# EAGLE board Audio_Test_Board (EAGLE 9.6.2)
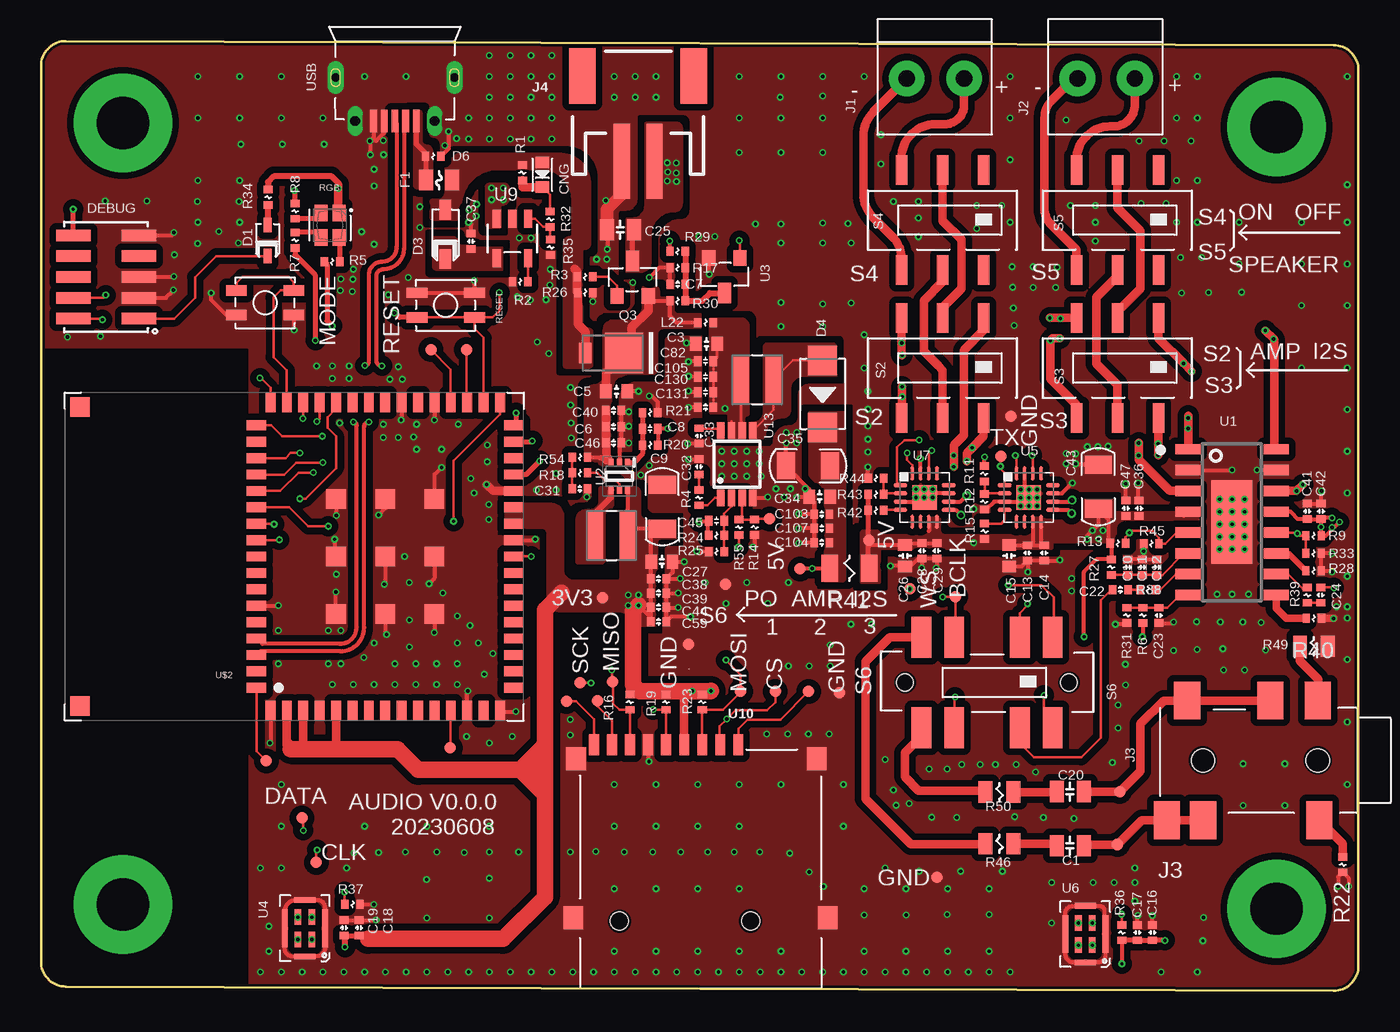
[diagram p3: board, top side]
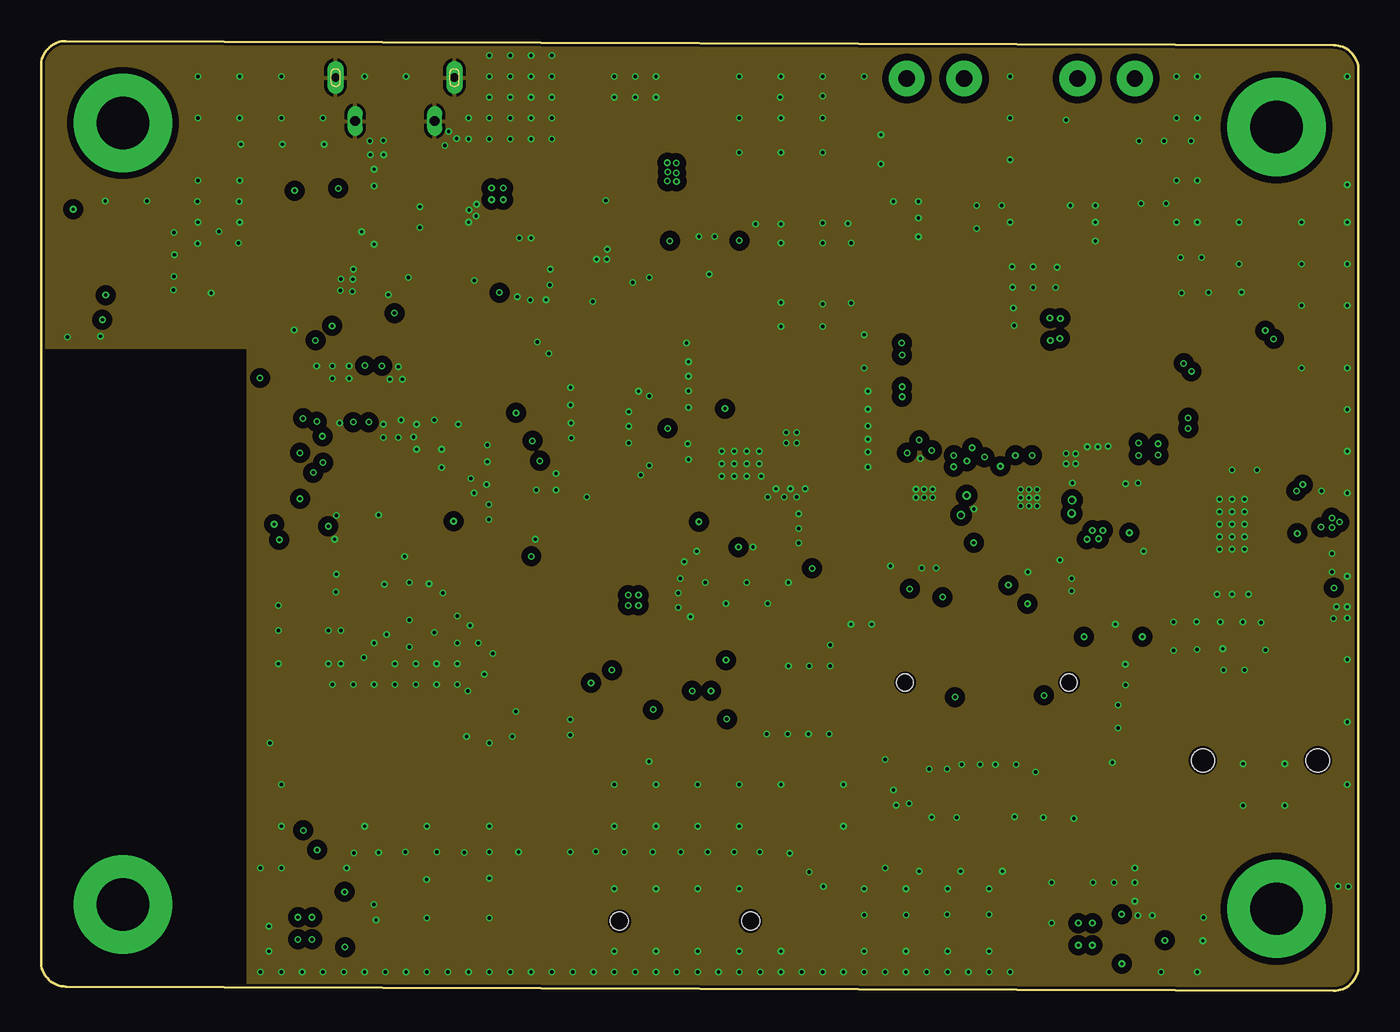
[diagram p4: board, inner layer Route2]
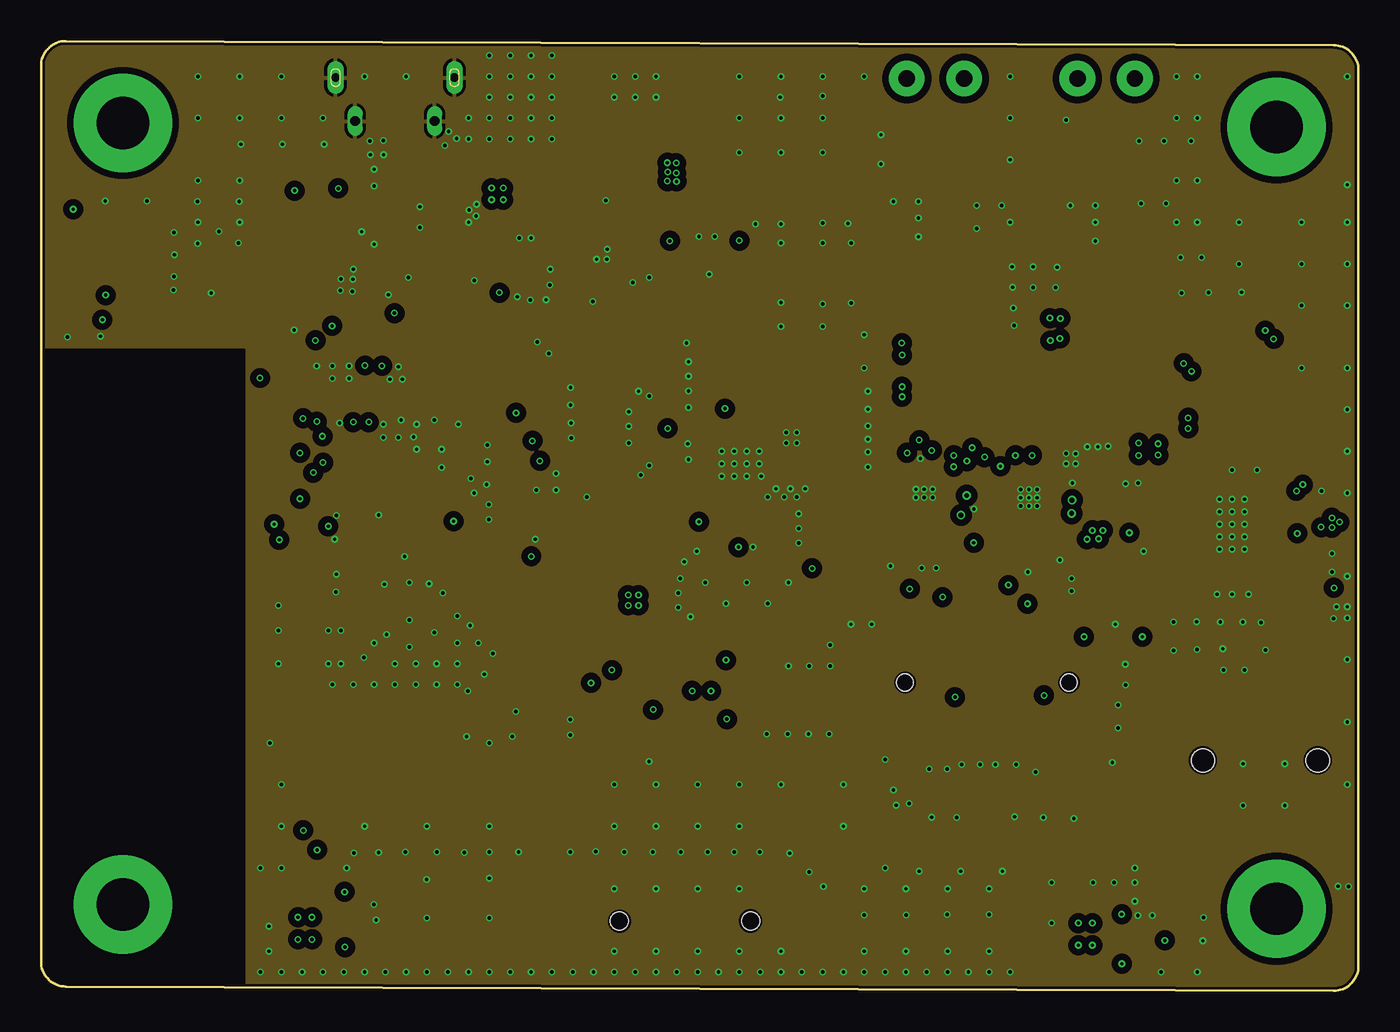
[diagram p5: board, inner layer Route15]
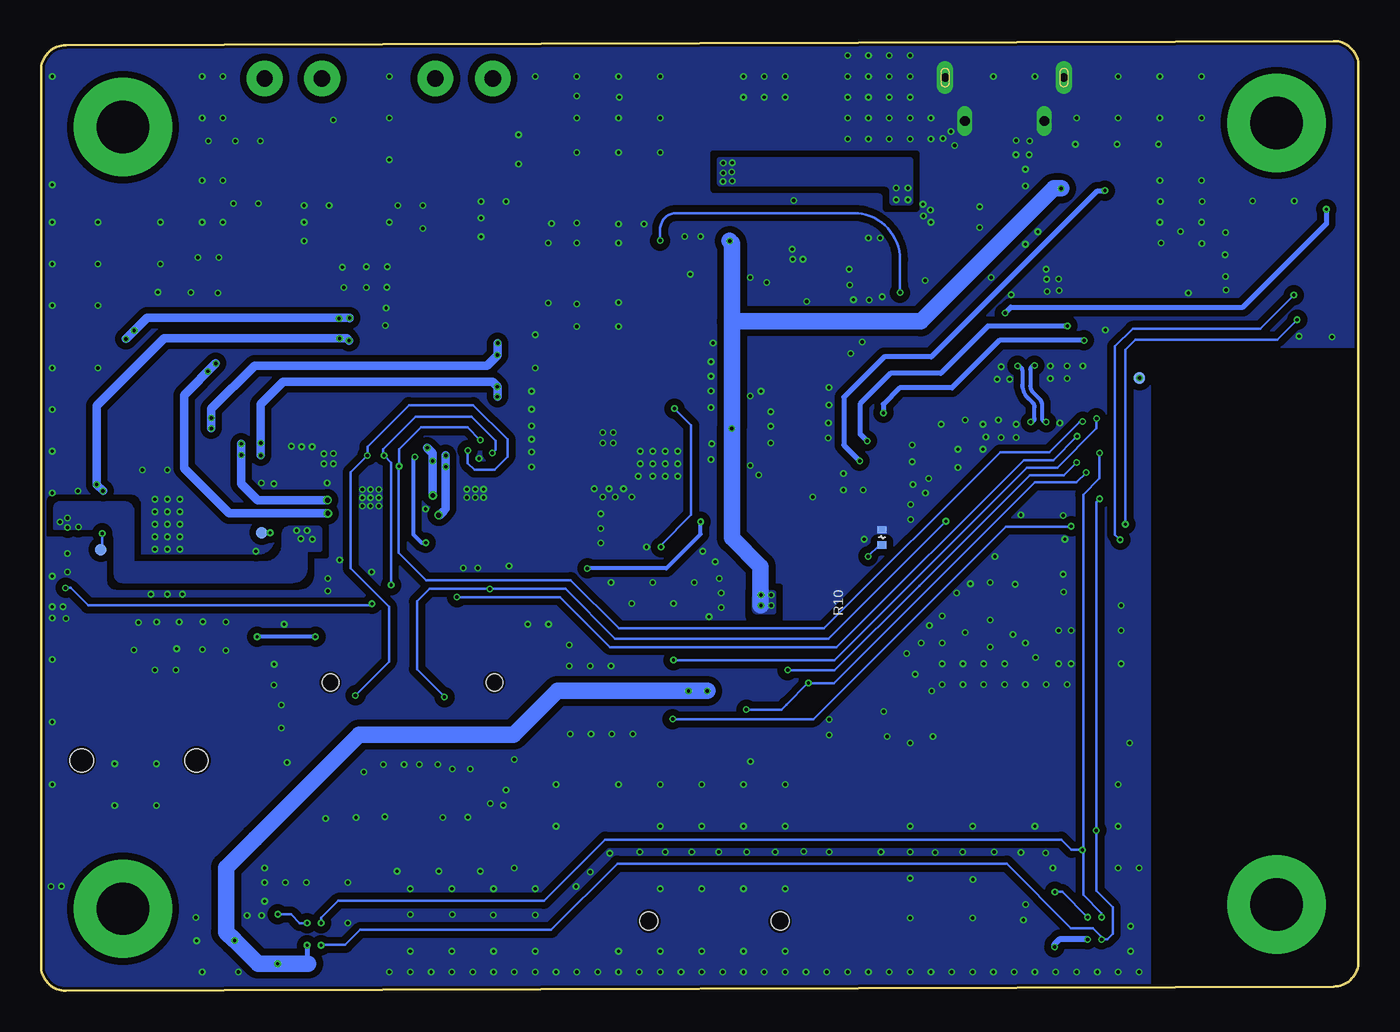
[diagram p6: board, bottom side, seen from below]

Size 80.37 x 57.91 mm. Coordinates in mm from the lower left corner, seen from the top.
Outline: 1.52,0.25 arc-90 0,1.78 0,56.39 arc-90 1.52,57.91 78.84,57.66 arc-90 80.37,56.13 80.37,1.52 arc-90 78.84,0 1.52,0.25
Copper layers (1+2*15+16): Top 0.035mm / dielectric 0.2mm / Route2 0.035mm / dielectric 0.15mm / Route15 0.035mm / dielectric 0.2mm / Bottom 0.035mm
Design rules "default *": minimum track width 4mil, minimum drill 0.1mm, track to track 8mil, track to pad 4mil, pad to pad 4mil, via to via 6mil, smd to smd 0mil, copper to edge 6mil, drill to drill 6mil, minimum pad ring 4mil, minimum via ring 4mil, stop-mask expansion 0mil, vias tented up to drill 20mil, thermal gap 8mil
Net classes: 0 default: width 0.152 mm, drill 0.203 mm, clearance 0.152 mm; 1 power: width 0.254 mm, drill 0.203 mm, clearance 0.406 mm; 2 DIIFF: width 0.242 mm, clearance 0.152 mm
tRestrict: 2 lines

## Footprints (pad centres in the part's own frame; a part is rotated, then mirrored left to right if it is on the bottom)
TS-1185A-020 = smd 1.27 x 0.635: 1 -1.75,0.752; 2 1.75,0.752; 3 -1.75,-0.752; 4 1.75,-0.752
C0805 = smd 0.85 x 1.3: 1 -0.8,0; 2 0.85,0
C0603 = smd 0.7 x 0.85: 1 -0.65,0; 2 0.65,0
C-0402 = smd 0.45 x 0.55: 1 -0.47,0; 2 0.47,0
C0402 = smd 0.45 x 0.6: 1 -0.47,0; 2 0.47,0
C1206 = smd 1.1 x 1.65: 1 -1.35,0; 2 1.35,0
LED0603 = smd 0.7 x 0.8: 1 -0.75,0; 2 0.75,0
SOD-323 = smd 0.9 x 0.5: 1 -0.95,0; 2 0.95,0
DIODE-DO-220AA_NT(SMP) = smd 0.762 x 1.27: ANODE 2.349,0 | smd 2.337 x 2.464: CATHODE 0,0
SOD-123 = smd 1.2 x 0.7: 1 -1.5,0; 2 1.5,0
DO-214AC = smd 1.8 x 1.77: 1 -2.042,0; 2 2.042,0
R-0402S = smd 0.45 x 0.55: 1 -0.47,0; 2 0.47,0
CON5X2_1.27 = smd 0.7 x 2.1: 1 -2.54,-2; 2 -2.54,2; 3 -1.27,-2; 4 -1.27,2; 5 0,-2; 6 0,2; 7 1.27,-2; 8 1.27,2; 9 2.54,-2; 10 2.54,2
F0805 = smd 0.85 x 1.25: P$1 -0.8,0; P$2 0.8,0
1X2-3.5MM = drill 1 pad 2.184: 1 1.8,0; 2 -1.7,0
PJ3825 = smd 2.3 x 1.6: P$1 -3.65,4.55; P$2 3.65,4.65; P$3 -3.65,1.65; P$4 3.65,-2.45; P$5 3.65,-4.65; P$6 -3.65,-3.425 | hole 1.4: 0,4.55; 0,-2.45
JST-2-SMD = smd 1 x 4.6: 1 -1,-3.7; 2 1,-3.7 | smd 1.6 x 3.4: NC1 -3.4,1.5; NC2 3.4,1.5
INDUCTOR-VLS-E = smd 1 x 3: P$1 -1,0; P$2 1,0
TRON = smd 1.2 x 0.6: 1 0.6,15.45; 2 0.6,14.45; 3 0.6,13.45; 4 0.6,12.45; 5 0.6,11.45; 6 0.6,10.45; 7 0.6,9.45; 8 0.6,8.45; 9 0.6,7.45; 10 0.6,6.45; 11 0.6,5.45; 12 0.6,4.45; 13 0.6,3.45; 14 0.6,2.45; 15 0.6,1.45; 33 19.4,1.45; 34 19.4,2.45; 35 19.4,3.45; 36 19.4,4.45; 37 19.4,5.45; 38 19.4,6.45; 39 19.4,7.45; 40 19.4,8.45; 41 19.4,9.45; 42 19.4,10.45; 43 19.4,11.45; 44 19.4,12.45; 45 19.4,13.45; 46 19.4,14.45; 47 19.4,15.45 | smd 0.6 x 1.2: 16 2,0.6; 17 3,0.6; 18 4,0.6; 19 5,0.6; 20 6,0.6; 21 7,0.6; 22 8,0.6; 23 9,0.6; 24 10,0.6; 25 11,0.6; 26 12,0.6; 27 13,0.6; 28 14,0.6; 29 15,0.6; 30 16,0.6; 31 17,0.6; 32 18,0.6; 48 18,16.3; 49 17,16.3; 50 16,16.3; 51 15,16.3; 52 14,16.3; 53 13,16.3; 54 12,16.3; 55 11,16.3; 56 10,16.3; 57 9,16.3; 58 8,16.3; 59 7,16.3; 60 6,16.3; 61 5,16.3; 62 4,16.3; 63 3,16.3; 64 2,16.3 | smd 1.2 x 1.2: 65 6.5,11.45; 66 6.5,8.45; 67 6.5,5.45; 68 10,11.45; 69 10,8.45; 70 10,5.45; 71 13.5,11.45; 72 13.5,8.45; 73 13.5,5.45; 74 19.12,27.07; 75 0.88,27.07
SOT-23 = smd 0.8 x 0.95: 1 -0.95,-1; 2 0.95,-1 | smd 0.8 x 1.25: 3 0,1.15
R1206 = smd 1 x 1.65: 1 -1.2,0; 2 1.2,0
R0805 = smd 0.85 x 1.3: 1 -0.85,0; 2 0.85,0
PLCC4-2MM-RGB = smd 1 x 0.8: BLUE -0.75,-0.55; CA 0.75,-0.55; GREEN -0.75,0.55; RED 0.75,0.55
SS-3235S-L1_SMD = smd 0.7 x 1.8: 1 -2.5,3.05; 2 0,3.05; 3 2.5,3.05; 4 -2.5,-3.05; 5 0,-3.05; 6 2.5,-3.05
SWITCH-JS207011SCQNR = smd 1.2 x 2.5: 1 -4,-2.75; 2 -2,-2.75; 3 2,-2.75; 4 4,-2.75; 5 -4,2.75; 6 -2,2.75; 7 2,2.75; 8 4,2.75 | hole 1: -5,0; 5,0
TP0.7MM = smd 0.7 x 0.7: P$1 0,0
PARTICLE-SZ_SOIC16 = smd 0.635 x 1.524: 1 -4.445,-2.695; 2 -3.175,-2.695; 3 -1.905,-2.695; 4 -0.635,-2.695; 5 0.635,-2.695; 6 1.905,-2.695; 7 3.175,-2.695; 8 4.445,-2.695; 9 4.445,2.695; 10 3.175,2.695; 11 1.905,2.695; 12 0.635,2.695; 13 -0.635,2.695; 14 -1.905,2.695; 15 -3.175,2.695; 16 -4.445,2.695 | smd 5.1 x 2.5: THERM 0,0
SOTFL50P160X60-6N = smd 0.475 x 0.3: 1 -0.838,0.5; 2 -0.838,0; 3 -0.838,-0.5; 4 0.838,-0.5; 5 0.838,0; 6 0.838,0.5
PARTICLE-SZ_SOT-23 = smd 0.8 x 0.95: 1 -0.95,-1; 2 0.95,-1 | smd 0.8 x 1.25: 3 0,1.15
MP34DT = smd 0.95 x 0.4: 1 -0.675,-0.425; 2 0.675,-0.425; 3 0.675,0.425; 4 -0.675,0.425 | smd 2.3 x 0.35: 5 0,1.225; 6 0,-1.225 | smd 0.35 x 1.3: 7 1.725,0; 8 -1.725,0
QFN16 = smd 0.85 x 0.25: 1 -1.475,0.75; 2 -1.475,0.25; 3 -1.475,-0.25; 4 -1.475,-0.75; 9 1.475,-0.75; 10 1.475,-0.25; 11 1.475,0.25; 12 1.475,0.75 | smd 0.25 x 0.85: 5 -0.75,-1.475; 6 -0.25,-1.475; 7 0.25,-1.475; 8 0.75,-1.475; 13 0.75,1.475; 14 0.25,1.475; 15 -0.25,1.475; 16 -0.75,1.475 | smd 1.5 x 1.5: TH 0,0
SOT-23-5 = smd 1.1 x 0.508: 1 -1.2,0.953; 2 -1.2,0; 3 -1.2,-0.953; 4 1.2,-0.953; 5 1.2,0.953
MICROSD = smd 0.6 x 1.3: 1 2.3,5.276; 2 1.2,5.276; 3 0.101,5.276; 4 -0.999,5.276; 5 -2.099,5.276; 6 -3.199,5.276; 7 -4.299,5.276; 8 -5.399,5.276; 9 -6.499,5.276 | smd 1.2 x 1.4: 10 -7.599,4.426; 11 -7.76,-5.276; 12 7.76,-5.276; 13 7.081,4.426 | hole 1.1: -4.95,-5.478; 3.05,-5.475
MSOP8 = smd 0.45 x 1: 1 -0.975,-2.05; 2 -0.325,-2.05; 3 0.325,-2.05; 4 0.975,-2.05; 5 0.975,2.05; 6 0.325,2.05; 7 -0.325,2.05; 8 -0.975,2.05
MICRO_USB = smd 0.4 x 1.4: 1 1.3,0.1; 2 0.65,0.1; 3 0,0.1; 4 -0.65,0.1; 5 -1.3,0.1 | drill 0.6 pad 0.75 long: 6 2.425,0.1 | drill 0.5 pad 1 long: 7 3.625,2.75; 8 -3.625,2.75 | drill 0.6 pad 0.65 long: 9 -2.425,0.1

## Placement (x,y rotation side)
BUTTON  TS-1185A-020  [TS-1185A-020]  13.68,41.96 0 top
C1  0.47uF  [C0805]  62.76,8.85 0 top
C3  10uF  [C0603]  40.59,39.45 180 top
C5  10uF  [C0603]  35.1,36.55 0 top
C6  1nF/10V  [C-0402]  34.92,34.39 0 top
C7  0.1uF  [C-0402]  38.84,43.07 180 top
C8  330pF  [C0402]  37.16,34.26 0 top
C9  100uF  [C1206]  37.9,29.51 90 top
C10  1uF  [C-0402]  66.29,25.83 270 top
C11  100nF  [C-0402]  67.18,25.83 270 top
C12  100nF  [C-0402]  68.07,25.83 270 top
C13  100nF  [C-0402]  60.17,26.7 90 top
C14  100nF  [C-0402]  61.19,26.7 90 top
C15  10uF  [C0603]  59.05,26.52 270 top
C16  1uF  [C-0402]  67.79,3.55 270 top
C17  100nF  [C-0402]  66.88,3.55 270 top
C18  1uF  [C-0402]  19.41,3.84 270 top
C19  100nF  [C-0402]  18.49,3.84 270 top
C20  0.47uF  [C0805]  62.76,12.15 0 top
C22  0.47uF  [C-0402]  65.84,24.46 180 top
C23  1uF  [C-0402]  68.17,22.89 270 top
C24  0.47uF  [C-0402]  78.05,24.13 90 top
C25  10uF  [C0805]  35.33,46.41 0 top
C26  100nF  [C-0402]  53.75,26.82 90 top
C27  10uF  [C0603]  37.87,26.16 0 top
C28  100nF  [C-0402]  54.64,26.82 90 top
C29  10uF  [C0603]  52.7,26.52 270 top
C31  10nF  [C-0402]  32.87,30.61 180 top
C32  1200pF  [C-0402]  40.13,31.95 90 top
C33  33nF  [C-0402]  40.13,33.83 270 top
C34  10uF  [C0603]  47.5,30.12 180 top
C35  100uF  [C1206]  46.79,32 180 top
C36  100nF  [C-0402]  66.98,29.41 270 top
C37  0.1uF  [C-0402]  26.24,45.69 90 top
C38  0.1UF  [C-0402]  37.67,25.12 180 top
C39  1000pF  [C-0402]  37.67,24.25 180 top
C40  0.1UF  [C-0402]  34.92,35.38 180 top
C41  100nF  [C-0402]  77.24,29.24 270 top
C42  1uF  [C-0402]  78.08,29.24 270 top
C43  47uF  [C1206]  64.49,30.73 270 top
C44  100pF  [C-0402]  37.67,23.38 180 top
C45  3.3nF  [C0402]  41.2,28.65 180 top
C46  100pF  [C-0402]  34.92,33.4 0 top
C47  1uF  [C-0402]  66.17,29.41 270 top
C59  33pF  [C-0402]  37.67,22.5 180 top
C82  0.1uF  [C0402]  40.54,38.38 180 top
C103  100pF  [C-0402]  47.62,29.06 180 top
C104  1000pF  [C-0402]  47.62,27.33 180 top
C105  0.1uF  [C0402]  40.54,37.44 180 top
C107  0.1uF  [C-0402]  47.62,28.19 180 top
C130  1000pF  [C0402]  40.54,36.5 180 top
C131  100pF  [C-0402]  40.54,35.59 180 top
CNG  ORANGE  [LED0603]  30.58,49.76 270 top
D1  B5817WS  [SOD-323]  13.82,45.75 270 top
D2  SS3P3-M3/84A  [DIODE-DO-220AA_NT(SMP)]  35.56,38.89 180 top
D3  B5819w  [SOD-123]  24.66,46.13 270 top
D4  SS32/DO-214AC  [DO-214AC]  47.68,36.4 270 top
D6  ESD  [R-0402S]  23.93,50.88 180 top
DEBUG  CON5X2  [CON5X2_1.27]  3.98,43.53 90 top
F1  6V 1A  [F0805]  24.28,49.43 0 top
J1  1X2-3.5MM  [1X2-3.5MM]  54.61,55.63 180 top
J2  1X2-3.5MM  [1X2-3.5MM]  65.02,55.63 180 top
J3  PJ3825  [PJ3825]  73.33,14.05 270 top
J4  CW2001-02T1-H01-BD  [JST-2-SMD]  36.42,54.28 0 top
L1  1uH  [INDUCTOR-VLS-E]  43.69,37.26 0 top
L2  1uH  [INDUCTOR-VLS-E]  34.8,27.76 0 top
L22  BLM15PX121  [R-0402S]  40.54,40.74 180 top
LOGO  PARTICLE-LOGO  [PARTICLE-LOGO]  46.54,43.75 90 top
P2  TRON  [TRON]  29.45,16.48 90 top
Q3  PMOS  [SOT-23]  36.09,43.36 0 top
R1  3K  [R-0402S]  29.36,49.89 90 top
R2  2K  [R-0402S]  29.24,43.23 180 top
R3  10K  [R-0402S]  33.2,43.54 0 top
R4  12K  [R-0402S]  40.13,30.07 270 top
R5  1K  [R-0402S]  17.76,44.45 0 top
R6  NC  [R-0402S]  67.21,22.89 270 top
R7  1K  [R-0402S]  15.5,45.77 90 top
R8  1K  [R-0402S]  15.5,47.54 270 top
R9  NC  [R-0402S]  77.62,27.74 180 top
R10  12K 1%  [R-0402S]  29.06,27.64 90 bottom
R11  NC  [R-0402S]  57.53,31.52 270 top
R12  0R  [R-0402S]  57.53,29.82 90 top
R13  NC  [R-0402S]  65.68,27.28 0 top
R14  NC  [R-0402S]  43.54,28.26 270 top
R15  1M  [R-0402S]  57.56,28.02 90 top
R16  10K  [R-0402S]  35.92,17.6 270 top
R17  NC  [R-0402S]  38.84,44.08 0 top
R18  1K  [R-0402S]  32.87,31.57 0 top
R19  10K  [R-0402S]  38.13,17.6 270 top
R20  68K  [R-0402S]  37.16,33.27 180 top
R21  15K  [R-0402S]  37.16,35.26 0 top
R22  75R  [R-0402S]  79.4,7.7 90 top
R23  10K  [R-0402S]  40.34,17.6 270 top
R24  30K  [R-0402S]  41.2,27.76 0 top
R25  10K  [R-0402S]  41.2,26.77 0 top
R26  100K  [R-0402S]  33.2,42.57 180 top
R27  0R  [R-0402S]  65.28,25.83 270 top
R28  0R  [R-0402S]  77.62,25.6 180 top
R29  NC  [R-0402S]  38.84,45.08 0 top
R30  0R  [R-0402S]  38.84,42.06 0 top
R31  NC  [R-0402S]  66.24,22.89 270 top
R32  1K  [R-0402S]  31.06,47.04 90 top
R33  NC  [R-0402S]  77.62,26.67 0 top
R34  1K  [R-0402S]  13.85,48.39 90 top
R35  6.2K  [R-0402S]  31.09,45.34 270 top
R36  10K  [R-0402S]  65.92,3.55 270 top
R37  0R  [R-0402S]  19,5.28 180 top
R38  20K  [R-0402S]  67.51,24.46 0 top
R39  20K  [R-0402S]  77.24,24.13 90 top
R40  0R  [R-0402S]  77.65,22.71 180 top
R41  0R  [R1206]  49.31,25.77 180 top
R42  0R  [R-0402S]  50.93,29.29 0 top
R43  NC  [R-0402S]  50.93,30.26 0 top
R44  0R  [R-0402S]  50.93,31.24 0 top
R45  NC  [R-0402S]  67.72,27.25 180 top
R46  0R  [R0805]  58.47,8.96 180 top
R49  0R  [R0805]  77.65,21.01 0 top
R50  0R  [R0805]  58.47,12.11 180 top
R54  200K  [R-0402S]  32.87,32.54 0 top
R55  10K  [R-0402S]  42.57,28.26 90 top
RESET  TS-1185A-020  [TS-1185A-020]  24.69,41.81 0 top
RGB  RGB-LED-CLMVB-FKARGB  [PLCC4-2MM-RGB]  17.63,46.69 90 top
S2  SS-3235S-L1_SMD  [SS-3235S-L1_SMD]  54.99,37.97 0 top
S3  SS-3235S-L1_SMD  [SS-3235S-L1_SMD]  65.66,37.97 0 top
S4  SS-3235S-L1_SMD  [SS-3235S-L1_SMD]  54.99,46.99 0 top
S5  SS-3235S-L1_SMD  [SS-3235S-L1_SMD]  65.66,46.99 0 top
S6  SWITCH_JS207011SCQNR  [SWITCH-JS207011SCQNR]  57.71,18.8 180 top
TP1  TP  [TP0.7MM]  16.79,7.82 0 top
TP2  TP  [TP0.7MM]  34.85,18.85 0 top
TP3  TP  [TP0.7MM]  55.78,24.03 0 top
TP4  TP  [TP0.7MM]  24.97,14.81 0 top
TP5  TP  [TP0.7MM]  13.74,14.02 0 top
TP6  TP  [TP0.7MM]  23.78,39.09 0 top
TP7  TP  [TP0.7MM]  53,24.5 90 top
TP8  TP  [TP0.7MM]  42.67,18.26 0 top
TP9  TP  [TP0.7MM]  58.55,32.59 270 top
TP10  TP  [TP0.7MM]  15.93,10.54 0 top
TP11  TP  [TP0.7MM]  25.96,39.09 0 top
TP12  TP  [TP0.7MM]  32.05,17.65 0 top
TP13  TP  [TP0.7MM]  44.45,28.78 180 top
TP14  TP  [TP0.7MM]  44.8,18.26 0 top
TP15  TP  [TP0.7MM]  46.82,18.26 0 top
TP16  TP  [TP0.7MM]  65.8,12.14 90 top
TP17  TP  [TP0.7MM]  65.66,8.92 90 top
TP18  TP  [TP0.7MM]  33.96,17.68 0 top
TP19  TP  [TP0.7MM]  32.89,18.77 0 top
TP20  TP  [TP0.7MM]  39.5,21.13 0 top
TP21  TP  [TP0.7MM]  54.64,6.93 0 top
TP22  TP  [TP0.7MM]  48.69,18.16 0 top
TP23  TP  [TP0.7MM]  41.76,24.79 0 top
TP24  TP  [TP0.7MM]  59.16,35.03 0 top
TP25  TP  [TP0.7MM]  50.5,27.46 0 top
TP26  TP  [TP0.7MM]  34.26,23.95 0 top
TP27  TP  [TP0.7MM]  46.3,25.73 0 top
TP28  TP  [TP0.7MM]  76.71,26.9 0 bottom
TP29  TP  [TP0.7MM]  66.9,27.94 0 bottom
TP30  TP  [TP0.7MM]  13.36,37.36 0 bottom
U1  PARTICLE-SZ_PAM8403DRSOP16  [PARTICLE-SZ_SOIC16]  72.64,28.58 270 top
U2  MP1601GTF-Z  [SOTFL50P160X60-6N]  35.28,31.37 270 top
U3  Reset IC_BL8506-33NRM  [PARTICLE-SZ_SOT-23]  41.68,43.69 180 top
U4  MP34DT  [MP34DT]  16.1,3.81 90 top
U5  MAX98357A/BQFN16  [QFN16]  60.25,30.07 0 top
U6  MP34DT  [MP34DT]  63.7,3.45 90 top
U7  MAX98357A/BQFN16  [QFN16]  53.9,30.07 0 top
U9  XC6802  [SOT-23-5]  28.75,45.87 270 top
U10  MICROSD  [MICROSD]  40.23,9.73 0 top
U13  ADP1613MSOP8  [MSOP8]  42.44,32.11 0 top
USB  MICRO_USB_5P  [MICRO_USB]  21.59,52.93 0 top

## Tracks (layer width: path | path; a pad name or v marks a point on that pad's centre or on a via)
3V3  (via drill 0.2)
  Top 0.254: R29.1 38.37,45.71 v38.35,45.72 | R20.1 C8.2 37.66,34.29 v38.23,34.29 | 37.2,25.17 C38.2 | C38.2 C39.2 C44.2 C59.2 37.2,22.75 v36.45,23.5 | C38.2 37.2,26.14 C27.1 37.22,27.92 37.47,28.17 | C9.1 37.47,28.17 | 37.47,28.17 36.2,28.17 | 36.2,28.17 35.57,28.17 35.78,28.38 U2.6 | 36.2,28.17 L2.P$2 | 30.73,22.73 30.73,23.11 | R36.2 65.92,1.67 65.93,1.67 v65.93,1.65 | 19.94,3.17 19.61,3.17 C18.2 | v40.86,18.29 40.65,18.07 | 15.11,14.86 15.11,16.96 P2.2 15,15.42 16,14.42 P2.3
  Top 0.305: v68.56,3.07 68.54,3.08 C16.2 C17.2 R36.2 | C19.2 C18.2 20.13,3.37
  Top 0.381: RGB.CA 18.18,49.22 17.74,49.66 14.2,49.66 13.85,49.31 R34.2 | v18.54,2.67 18.54,3.31 C19.2 | R36.2 65.9,3.08
  Top 0.508: 39.12,18.07 R19.1 R16.1 35.92,19.11 36.11,19.3 | 39.12,18.07 R23.1 | 39.12,18.07 39.23,17.95 U10.4 | v18.14,48.92 18.14,47.48 RGB.CA | P2.27 28.84,29.46 | P2.2 15,14.97 15.11,14.86 15.24,14.73 | P2.3 16,14.86 16.26,14.61 | P2.5 18,14.82 17.91,14.73
  Top 1.016: 30.73,14.86 30.73,22.73 30.73,23.24 31.75,24.26 | 30.73,14.86 30.73,13.46 | v36.45,23.5 36.11,23.16 36.11,19.3 36.11,18.67 36.51,18.27 40.85,18.27 v40.86,18.29 | 19.94,3.17 28.18,3.17 30.73,5.71 30.73,11.94 | 30.73,13.46 29.21,13.46 | 29.21,13.46 23.01,13.46 21.74,14.73 17.91,14.73 15.24,14.73 | 30.73,13.46 30.73,11.94 | 29.21,13.46 30.61,14.86 30.73,14.86 | 29.21,13.46 30.73,11.94
  Bottom 0.254: U6.1 | v65.93,1.65 | 67.31,9.27 66.52,10.06
  Bottom 0.305: U6.1 64.13,1.71 64.07,1.65 63.92,1.5
  Bottom 0.381: U4.1 18.25,3.13 18.54,2.85 v18.54,2.67
  Bottom 1.016: v36.45,23.5 36.47,23.52 36.47,25.86 38.23,27.62 v38.23,34.29 38.23,40.82 | v18.14,48.92 18.59,48.92 26.7,40.82 38.23,40.82 | v38.35,45.72 38.23,45.59 38.23,40.82 | 64.07,1.65 67.12,1.65 v68.54,3.07 v68.56,3.07 69.07,3.58 69.07,7.51 67.31,9.27 60.96,15.62 51.54,15.62 48.87,18.29 v40.86,18.29 v39.72,18.29
  other vias: 16.53,3.13 64.13,2.78 35.81,23.5 35.81,24.13 36.45,24.13
  pour Top (no thermals): 28.32,29.72 31.11,29.72 arc-90 31.88,28.96 31.88,25.65 arc90 32.51,25.02 35.18,25.02 arc90 35.31,25.15 35.31,29.06 arc-90 35.43,29.18 arc90 35.71,29.46 35.71,30.73 36.2,30.73 arc-90 36.58,30.35 36.58,29.08 arc90 36.96,28.7 38.73,28.7 38.73,27.56 37.85,27.56 arc90 37.59,27.3 37.59,22.23 36.2,22.23 arc-90 35.81,22.61 arc90 35.31,23.11 31.62,23.11 arc-90 30.86,23.88 30.86,27.94 arc90 30.61,28.19 28.32,28.19
  pour Bottom: 35.69,24.38 36.58,24.38 arc-90 36.96,24 36.96,23.88 36.96,23.24 arc-90 36.7,22.99 35.69,22.99 arc-90 35.56,23.11 35.56,23.88 35.56,24.26 arc-90
5V  (via drill 0.2)
  Top 0.254: C26.2 | 58.93,27.29 C15.1 C13.2 60.4,27.17 | C42.2 C41.2 76.67,28.77 76.23,29.21 U1.13 | C42.2 78.08,27.75 R9.1 78.36,27.74 v79.2,28.58 | C26.2 C28.2 | C26.2 52.83,27.29 52.83,27.3 C29.1 52.7,27.18 50.67,27.18 | v63.63,21.59 63.63,25.54 64.39,26.3 R27.1 65.28,27.34 R13.1 65.11,27.38 65.11,28.76 C43.2 64.49,28.42 63.8,27.74 v63.8,27.53 | R43.1 R42.1 50.46,28.5 50.46,28.18 | U7.7 54.15,28.03 | R11.1 57.53,32.51 v57.56,32.54 | U1.4 69.68,28.94 | R6.2 67.21,21.62 v67.18,21.59 | 60.4,27.17 60.96,27.17 | 60.96,27.17 C14.2 | U5.8 61,27.2 60.96,27.17 | v78.74,28.83 78.14,28.83 C42.2 | U5.7 60.5,27.26 60.4,27.17
  Top 0.3: R43.1 50.46,27.56
  Top 0.305: 50.46,28.5 50.46,27.56 50.46,25.82 R41.1
  Bottom 0.254: v63.63,21.59 v67.18,21.59 | v57.56,32.54 57.66,32.44 57.66,27.83 57.15,27.32 v56.9,27.32
  other vias: 64.77,28.07 64.14,28.07 64.52,27.56 78.74,28.24 78.08,28.27
  pour Top (no thermals): 50.55,27.81 53.85,27.81 arc90 54.1,28.07 54.1,28.96 54.74,28.96 arc-90 54.86,28.83 54.86,28.07 arc90 55.12,27.81 60.2,27.81 arc90 60.45,28.07 60.45,28.96 61.34,28.96 arc-90 61.72,28.58 61.72,27.05 arc-90 61.59,26.92 50.55,26.92 arc-90 50.42,27.05 50.42,27.69 arc-90
  pour Top (no thermals): 61.21,28.7 63.37,28.7 arc90 63.63,28.96 63.63,29.85 arc-90 63.75,29.97 65.28,29.97 arc-90 65.53,29.72 65.53,29.21 70.61,29.21 70.61,28.68 66.12,28.68 arc90 65.58,28.14 65.58,27.66 arc-90 65.23,27.3 61.21,27.3
  pour Bottom: 63.5,28.32 65.15,28.32 arc-90 65.66,27.81 65.66,27.18 arc90 66.67,26.16 74.7,26.16 74.7,29.21 arc-90 75.31,29.82 79.17,29.82 arc-90 79.58,29.41 79.58,28.14 76.58,28.14 arc90 75.89,27.46 75.89,25.4 arc-90 75.38,24.89 65.02,24.89 arc-90 64.14,25.78 64.14,26.8 63.37,26.8 arc-90 63.25,26.92 63.25,28.07 arc-90
  pour Top (no thermals): 49.99,27.89 49.99,24.94 arc90 50.09,24.84 51.1,24.84 arc90 51.21,24.94 51.21,27.79 arc90 50.9,28.09 50.19,28.09 arc90
5VIN  (via drill 0.2)
  Top 0.254: C45.2 40.68,28.6 | 40.68,28.6 v40.13,28.6 | R24.1 40.68,27.81 40.68,28.6 | R41.2 48.07,25.73 TP27.P$1 47.02,25.73 v47.04,25.76
  Bottom 0.254: v40.13,28.6 40.13,27.84 42.22,25.76 v47.04,25.76
  pour Top (no thermals): 46.84,35.31 49.07,35.31 49.07,25.15 arc-90 48.87,24.94 47.8,24.94 47.8,30.68 arc-90 46.84,31.65
/RST  (via drill 0.2)
  Top 0.152: U3.1 42.63,45.71 v42.6,45.74 | RESET.3 RESET.4 | v27.96,42.57 27.96,41.48 27.54,41.06 RESET.4 | RESET.4 26.08,41.06 | RESET.4 26.44,40.37 27,39.81 P2.34
  Top 0.305: DEBUG.10 v1.98,47.63 v1.97,47.65 | RESET.3 21.87,41.06 21.6,41.33 v21.57,41.33
  Bottom 0.152: 27.96,42.6 v27.96,42.57 27.96,42.93 | 42.57,45.77 v42.6,45.74 42.6,46.43 arc90 41.6,47.42 30.81,47.42 arc90 27.96,44.58 27.96,42.93 | 27.96,42.93 | 27.96,42.93 27.96,43.07
  Bottom 0.305: v21.57,41.33 21.21,41.68 7.04,41.68 1.97,46.76 v1.97,47.65
AMP_SPEAKER_N_L  (via drill 0.2)
  Top 0.508: U1.3 68.86,30.48 66.95,32.38 v66.95,32.64 v66.95,33.4 | v52.53,36.83 52.53,34.96 S2.4
  Bottom 0.508: v66.95,32.64 66.95,35.76 65.58,37.13 52.83,37.13 v52.53,36.83 v52.53,36.22
AMP_SPEAKER_N_R  (via drill 0.2)
  Top 0.508: v76.96,30.86 v76.58,30.48 U1.14 | S3.4 63.16,35.74 61.57,37.32 v61.57,39.65 61.7,39.78 v62.15,39.78
  Bottom 0.508: v76.58,30.48 v76.96,30.86 76.96,35.66 72.85,39.78 61.7,39.78 v61.57,39.65
AMP_SPEAKER_P_L  (via drill 0.2)
  Top 0.508: U1.1 69.98,33.02 v69.98,34.29 69.98,35.05 | v52.53,38.76 52.49,38.8 S2.1
  Bottom 0.152: v69.98,34.92 v69.98,34.29
  Bottom 0.508: v69.98,34.29 69.98,35.48 67.33,38.12 53.16,38.12 v52.53,38.76 52.5,38.79 v52.5,39.5
AMP_SPEAKER_P_R  (via drill 0.2)
  Top 0.152: v61.54,41.02 v61.55,41.02 | v62.18,41 62.21,41.02 S3.1
  Top 0.508: 75.29,33.07 U1.16 75.24,33.12 75.24,39.7 v75.18,39.75 v74.68,40.26 | v61.55,41.02 S3.1
  Bottom 0.508: v75.18,39.75 v75.17,39.75 73.9,41.03 v61.54,41.03 v61.54,41.02
AUDIO_CLK  (via drill 0.2)
  Top 0.152: v15.8,32.79 15.24,32.79 14.93,32.48 P2.50 | v16.84,8.58 16.79,8.53 TP1.P$1
  Bottom 0.152: v16.84,8.58 17.5,8.58 18.14,9.22 45.95,9.22 49.68,5.49 62.24,5.49 63.28,4.45 U6.3 | 15.68,4.63 U4.3 15.68,4.73 16.79,5.84 16.79,8.53 v16.84,8.58 | v15.8,32.79 15.8,31.24 16.79,30.25 16.79,8.64 v16.84,8.58
  other vias: 15.68,4.48 63.28,4.13
AUDIO_DATA  (via drill 0.2)
  Top 0.152: v15.8,30 16.13,30 18,31.87 18,33.82 17.48,34.34 17.48,34.98 18,35.5 P2.43 | 16.05,10.41 TP10.P$1 16,10.46 v16,9.78
  Bottom 0.152: U6.4 63.26,2.79 61.8,2.79 60.89,3.71 49.25,3.71 45.21,7.75 21.46,7.75 17.54,3.82 16.22,3.82 15.68,3.28 U4.4 15.32,3.13 14.99,3.47 14.99,5.08 16,6.1 v16,9.78 16,29.79 v15.8,30
  other vias: 15.68,3.13 63.28,2.78
AUDIO_L
  Top 0.152: C22.2 65.28,24.46 64.64,23.83 64.64,15.42 63.45,14.22 60.58,14.22 59.71,15.09 S6.6
AUDIO_R  (via drill 0.2)
  Top 0.152: v78.87,24.56 78.83,24.6 C24.2 | v60.17,23.6 60.17,23.5 59.71,23.03 S6.2
  Bottom 0.152: v60.17,23.6 60.27,23.5 77.5,23.5 78.56,24.56 v78.87,24.56
BLUE  (via drill 0.2)
  Top 0.305: R5.1 17.44,44.29 17.44,40.85 v17.75,40.54 | v29.97,33.53 29.92,33.48 P2.31
  Bottom 0.305: v17.75,40.54 22.59,40.54 25.48,37.64 28.55,37.64 30.4,35.79 30.4,33.96 v29.97,33.53
CH
  Top 0.152: U9.1 30.14,47.07 30.64,46.57 R32.1 31.06,45.83 R35.1
D5  (via drill 0.2)
  Top 0.152: DEBUG.2 3.68,40.98 v3.74,40.92 | P2.54 14.2,28.48 v14.22,28.45
  Bottom 0.152: v3.74,40.92 4.96,39.7 13.62,39.7 14.22,39.1 v14.22,28.45
D6  (via drill 0.2)
  Top 0.152: DEBUG.4 3.79,42.25 v3.95,42.41 | 14.61,27.56 v14.54,27.5 14.52,27.48 P2.55
  Bottom 0.152: v3.95,42.41 6,40.37 13.78,40.37 14.86,39.29 14.86,27.81 v14.54,27.5
D8-RSV  (via drill 0.2)
  Top 0.152: v29.91,26.48 P2.24
  Bottom 0.152: R10.1 29.22,27.17 v29.91,26.48
D9
  Top 0.152: P2.64 13.15,14.61 TP5.P$1
D15  (via drill 0.2)
  Top 0.152: TP30.P$1 13.4,37.36 14,36.77 P2.47
  other vias: 13.36,37.36
D+  (via drill 0.2 pad 0.41)
  Top 0.242: USB.3 21.69,52.93 21.69,45.34 arc-90 20.8,44.45 arc90 19.99,43.64 19.99,38.35 arc-90 v19.76,38.12 | P2.61 13.2,21.48 13.52,21.16 18.24,21.16 arc90 19.25,22.17 19.25,34.47 arc90 v19.05,34.67
  Bottom 0.242: v19.76,38.12 arc-90 20.02,37.87 20.02,36.87 arc-45 19.86,36.5 19.48,36.12 arc45 19.3,35.69 19.3,34.92 arc-90 v19.05,34.67
D-  (via drill 0.2 pad 0.41)
  Top 0.242: USB.2 22.14,52.93 22.14,45.25 arc-90 20.88,43.99 arc90 20.45,43.56 20.45,38.46 arc90 v20.8,38.1 | P2.62 13.37,20.7 18.26,20.7 arc90 19.71,22.15 19.71,34.39 arc-90 v19.99,34.67
  Bottom 0.242: v20.8,38.1 arc90 20.5,37.79 20.5,36.98 arc-45 20.14,36.12 19.87,35.85 arc45 19.76,35.59 19.76,34.9 arc90 v19.99,34.67
EARPHONE_L
  Top 0.508: S6.8 53.71,15.52 52.69,14.5 52.69,13.04 53.53,12.2 54.1,12.2 54.35,12.2 57.53,12.2 R50.2
EARPHONE_R
  Top 0.152: S6.4 53.71,21.59
  Top 0.508: S6.4 51.77,21.55 50.29,20.07 50.29,11.7 53.05,8.95 57.6,8.95 R46.2
EN
  Top 0.152: C31.2 R18.1 R54.1
FB
  Top 0.152: 36.69,32.74 R20.2 C8.1 R21.1 | U2.1 36.16,32.21
  Top 0.305: R21.1 36.69,32.74 36.16,32.21 35.99,32.21
GND  (via drill 0.2)
  Top 0.254: DEBUG.9 7.95,46.06 v8.11,46.23 | DEBUG.5 8.08,43.52 v8.11,43.56 | DEBUG.3 7.62,42.25 v8.09,42.72 | v78.11,30.48 78.08,30.46 C42.1 C41.1 | C46.2 C40.1 35.47,35.31 v35.86,35.31 | U2.2 35.28,33.22 35.34,33.29 35.31,33.32 C46.2 | C38.1 38.52,25.5 C27.2 v39.24,26.16 | C38.1 C39.1 | C39.1 C44.1 | C44.1 C59.1 38.44,22.81 v39.62,22.81 | C34.2 47.16,29.82 C104.2 46.25,27.33 v46.23,27.3 | C34.2 46.85,30.59 C35.2 45.44,33.37 v45.47,33.4 | U13.4 44.28,30.06 v44.32,30.1 | R12.1 57.67,29.35 58.15,29.82 U5.3 59.54,29.82 59.76,30.04 v59.76,30.06 | C26.1 C28.1 54.63,25.81 v54.61,25.78 | C26.1 53.73,26.37 53.51,26.37 53.01,25.87 C29.2 52.66,25.91 v51.82,25.91 | C13.1 C14.1 62.12,26.23 v62.15,26.26 | C13.1 59.81,25.87 C15.2 | U7.15 v53.65,32.46 | U7.3 53.31,29.82 53.56,30.07 U7.TH | U5.11 62.28,30.32 v62.92,30.96 | v15.44,40.28 15.43,40.29 BUTTON.4 | BUTTON.3 11.32,41.2 10.38,42.15 v10.38,42.55 | R25.1 40.03,26.77 v40.01,26.8 | R44.1 50.46,31.92 v50.44,31.93 | R14.2 43.54,27.15 v43.43,27.05 | C34.2 46.82,30.1 v46.1,30.1 | C103.2 46.25,29.06 v46.23,29.08 | C107.2 v46.23,28.19 | v40.77,43.69 40.73,43.72 U3.2 | v37.11,43.48 37.7,44.08 R17.1 C7.2 | R26.1 33.67,42.05 v33.66,42.04 | 34.53,46.85 C25.1 34.54,46.39 v34.54,45.21 | 34.53,47.61 35.43,48.51 35.43,49.53 35.31,49.66 | C47.1 v66.17,30.91 | C36.1 66.93,29.93 v66.93,30.96 | v78.74,26.67 R33.2 R28.1 78.66,25.6 v78.74,25.53 | C23.2 69.02,22.42 v69.09,22.48 | R31.2 66.18,22.35 v65.53,22.35 | USB.5 20.29,52.04 v20.07,51.82 | USB.4 20.94,52.31 20.45,51.82 v20.07,51.82 | v20.07,51.82 20.07,51 v20.09,50.98 | v24.87,52.4 24.87,51.35 D6.1 | v26.09,46.86 26.24,46.71 C37.2 | P2.71 v18.01,28.98
  Top 0.254: P2.72 21,29.41 v20.6,29.01 | P2.73 24,31.47 v24.43,31.9 | P2.70 24,25.14 v23.68,24.82 | v24,21.84 v24,21.85 P2.67 | P2.66 21,21.8 v21.08,21.72 | P2.65 17.95,23.03 17.95,24.34 v17.98,24.31 | P2.68 17.91,26.57 v17.91,27.53 | P2.69 21,24.84 v20.95,24.79 | v66.9,4.59 66.88,4.56 C17.1 | C16.1 v67.79,4.59 | C19.1 C18.1 20.43,4.3 v20.45,4.32 | P2.13 26,18.25 v26.04,18.29 | P2.15 28.06,17.02 v28.96,17.02 | v26.44,43.31 v26.44,43.3 RESET.2 RESET.1 | P2.1 14,15.14 v13.97,15.11 | P2.25 30.09,27.48 v30.15,27.53 | U1.2 v72.64,31.75 | U10.6 37.03,14.02 v37.08,13.97 | C9.2 | C32.2 40.09,32.38 v39.5,32.38 | C3.2 39.42,39.45 v39.37,39.5 | C82.2 39.52,38.38 v39.5,38.35 | C105.2 39.52,37.44 v39.5,37.46 | C130.2 39.57,36.5 v39.5,36.58 | C131.2 39.52,35.59 v39.5,35.56 | R21.2 37.63,35.89 37.25,36.27 v37.11,36.27 | v36.45,36.55 C5.2 | C33.2 v39.46,33.36 v39.45,33.35 | C38.1 38.96,25.12 v38.99,25.15 | C39.1 v38.85,24.25 v38.86,24.26 | C44.1 v38.86,23.37 | C26.1 53.75,25.81 v53.72,25.78 | C11.1 67.25,26.37 v67.25,26.8 R45.2 | C11.1 C12.1 | C11.1 C10.1 | U1.15 v74.17,31.75 | 60.07,30.48 60,30.55 U5.15 | C43.1 63.17,32.08 v63.12,32.13 | C31.1 33.34,30.17 v33.28,30.11 | P2.59 14.46,23.48 v14.48,23.5 | C6.2 35.83,34.39 v35.86,34.42 | C46.2 v35.86,33.4 | P2.37 v24,34.8 | P2.39 22,34.83 v21.97,34.8 | C13.1 60.2,26.2 v60.2,25.53 | 14.88,3.44 U4.5 14.88,4.04 | 14.88,4.04 14.88,4.85 arc-90 15.57,5.54 U4.7 arc-90 U4.7 16.87,5.54 arc-90 17.32,5.08 U4.6 arc90 U4.6 17.33,2.62 arc-90 16.82,2.11 16.13,2.11 arc90 U4.8 15.37,2.08 arc-90 14.86,2.59 14.86,4.02 arc-90 14.88,4.04 | R37.1 20.28,5.28 v20.3,5.27 | U7.11 54.63,30.32 v54.38,30.07 | v79.12,6.38 79.12,6.95 R22.1 79.76,6.87 v79.76,6.35
  Top 0.254: U6.5 62.48,4.74 arc-90 62.89,5.16 63.68,5.16 arc90 U6.7 64.57,5.18 arc-90 64.87,4.88 64.87,3.51 arc90 U6.6 64.93,2.17 arc-90 64.5,1.73 U6.8 62.98,1.73 arc-90 62.48,2.23 U6.5 arc90 U6.5
  Top 0.457: R40.1 v78.84,22.71
  Top 0.508: P2.28 27.56,30.48 v27.18,30.86
  Top 0.762: J4.1 35.42,48.55 34.53,47.66 34.53,47.61 34.53,46.85
  other vias: 74.7,20.78 31.06,43.99 53.37,30.58 53.88,30.58 54.38,30.58 53.37,30.07 53.88,30.07 59.76,30.57 60.26,30.57 60.77,30.57 59.76,29.55 60.26,30.06 60.77,30.06 60.26,29.55 60.77,29.55 63.83,33.17 64.47,33.17 65.1,33.2 63.12,32.74 62.53,32.13 62.53,32.77 34.52,44.6 33.88,44.6 24.64,51.54 25.35,51.97 20.88,51.84 20.9,50.98 26.11,47.6 26.57,47.96 26.54,47.24 41.53,32.89 42.29,32.89 43.05,32.89 41.53,32.13 42.29,32.13 43.05,32.13 41.53,31.37 42.29,31.37 43.05,31.37 17.78,37.34 21.29,37.29 21.79,38.05 16.81,38.1 56.9,29.39 40.51,24.89 43.05,24.89 45.59,24.89 41.78,23.62 44.32,23.62 48.13,21.08 49.4,22.35 50.67,22.35 48.13,19.81 46.86,19.81 45.59,19.81 26.09,51.94 27.36,51.94 28.63,51.94 29.9,51.94 31.17,51.94 26.09,53.21 27.36,53.21 28.63,53.21 29.9,53.21 31.17,53.21 27.36,54.48 28.63,54.48 29.9,54.48 31.17,54.48 28.63,55.75 27.36,55.75 31.17,55.75 29.9,55.75 27.36,57.02 28.63,57.02 31.17,57.02 29.9,57.02 34.98,55.75 36.25,55.75 37.52,55.75 34.98,54.48 36.25,54.48 37.52,54.48 42.6,55.75 45.14,55.75 47.68,55.75 50.22,55.75 42.6,53.21 45.14,53.21 47.68,53.21 42.6,51.1 45.14,51.1 47.68,51.1 49.23,46.79 45.14,45.59 45.14,41.96 45.14,40.51 47.68,40.51 47.68,41.88 47.68,45.59 47.68,46.81 49.43,45.59 49.43,41.94 50.22,40 50.22,37.97 59.11,55.75 59.11,53.21 59.11,50.67 59.11,46.86 69.27,55.75 69.27,53.21 69.27,49.4 69.27,46.86 73.08,46.86 76.89,46.86 76.89,44.32 76.89,41.78 76.89,37.97 73.08,44.32 9.58,55.75 12.12,55.75 14.66,55.75 19.74,55.75 22.28,55.75 9.58,53.21 12.12,53.21 14.66,53.21 17.2,53.21 9.58,49.4 12.12,49.4 12.12,46.86 9.58,46.86 1.61,39.87 3.62,39.91 3.92,48.16 6.46,48.16 14.66,12.57 47.69,54.55 13.39,7.49 14.66,10.03 14.66,7.49 27.36,15.11 19.74,10.03 23.55,10.03 27.36,10.03 23.52,6.78 27.36,6.86 23.55,4.45 27.36,4.45 34.98,12.57 37.52,12.57 40.06,12.57 42.6,12.57 45.14,12.57 34.98,10.03 37.52,10.03 40.06,10.03 42.6,10.03 34.98,6.22 37.52,6.22 40.06,6.22 42.6,6.22 37.52,2.41 34.98,2.41 40.06,2.41 42.6,2.41 45.14,2.41 51.49,7.49 53.56,7.28 56.1,7.28 58.64,7.28 48.95,12.57 48.95,10.03 50.22,2.41 52.76,2.41 55.3,2.41 57.84,2.41 66.73,7.49 66.73,6.6 66.73,5.46 65.46,6.6 64.19,6.6 61.65,6.6 57.84,6.22 55.3,6.22 52.76,6.22 50.22,6.22 44.27,15.65 45.54,15.65 46.81,15.65 48.08,15.65 70.54,55.75 70.54,53.21 70.54,49.4 70.54,46.86 19.05,43.99 19.02,43.38 19,42.65 18.26,42.7 18.29,43.41 21.18,42.44 19.56,46.28 20.32,45.52 22.4,43.48 20.32,50.09 20.32,49.07 23.11,47.8 23.11,46.53 14.73,51.61 17.27,51.61 12.19,51.61 18.8,37.34 18.8,38.1 17.78,38.1 20.88,34.54 22.91,34.54 22.91,33.02 24.43,33.02 25.45,34.54 27.23,33.27 27.23,32.26 26.21,31.24 20.32,21.21 17.78,18.67 19.68,20.32 18.29,19.94 14.48,19.94 14.48,21.97 17.53,21.97 18.29,21.97 17.53,19.94 22.48,24.89 22.48,22.61 22.48,20.96 22.18,26.47 79.68,55.75 79.68,49.15 79.68,46.86 79.68,44.32 79.68,41.78 79.68,37.97 79.68,35.43 79.68,32.89 79.68,30.35 79.68,25.27 79.68,22.73 79.68,20.19 79.68,16.38 79.68,12.57 73.33,11.3 75.87,11.3 73.33,13.84 75.87,13.84 72.14,19.56 73.41,19.56 70.92,4.47 70.87,3.05 71.88,29.97 72.64,29.97 73.41,29.97 71.88,29.21 72.64,29.21 73.41,29.21 72.64,28.45 73.41,28.45 71.88,28.45 71.88,27.69 72.64,27.69 73.41,27.69 71.88,26.92 72.64,26.92 73.41,26.92 27.05,19.3 27.56,20.57 25.4,22.86 24.51,24.26 45.34,30.1 44.83,30.61 45.72,30.61 46.61,30.61 43.94,31.37 43.81,32.13 43.81,32.89 46.1,33.4 45.47,34.04 46.1,34.04 19.05,18.67 20.32,18.67 21.59,18.67 22.86,18.67 24.13,18.67 25.4,18.67 21.59,19.94 22.86,19.94 24.13,19.94 25.4,19.94 25.4,21.21 26.67,21.21 26.17,22.28 18.01,25.4 18.21,34.62 20.88,33.73 21.79,33.73 22.73,33.76 22.05,37.29 32.28,16.54 32.28,15.6 13.89,2.41 13.89,3.94 13.39,1.14 14.66,1.14 15.93,1.14 17.2,1.14 18.47,1.14 19.74,1.14 21.01,1.14 22.28,1.14 23.55,1.14 24.82,1.14 26.09,1.14 27.36,1.14 28.63,1.14 29.9,1.14 31.17,1.14 32.44,1.14 33.71,1.14 34.98,1.14 36.25,1.14 37.52,1.14 38.79,1.14 40.06,1.14 41.33,1.14 42.6,1.14 43.87,1.14 45.14,1.14 46.41,1.14 47.68,1.14 48.95,1.14 50.22,1.14 51.49,1.14 52.76,1.14 54.03,1.14 55.3,1.14 56.57,1.14 57.84,1.14 59.11,1.14 68.32,1.14 70.54,1.14 62.87,24.38 62.87,25.15 69.52,44.7 70.79,44.7 62.79,47.88 64.31,47.88 64.31,46.86 64.31,45.72 67.11,48.01 68.63,48.01 66.98,51.82 68.5,51.82 70.15,51.82 62.53,53.09 57.07,47.88 58.6,47.88 57.07,46.48 51.99,48.13 53.52,48.13 53.52,47.12 53.52,45.97 51.23,50.42 51.23,52.2 25.96,15.49 28.75,15.49 27.31,29.64 27.31,28.74 26.41,30.34 30.21,30.54 31.41,30.54 31.41,31.54 52.97,11.42 52,12.25 52.17,11.32 51.5,14.11 29.06,42.32 37.11,32.03 36.58,31.45 32.35,33.7 32.33,34.62 32.3,35.71 32.3,36.77 30.98,38.86 30.27,39.57 31.04,43.03 29.84,42.11 30.81,42.14 36.09,43.18 40.13,46 41.1,46 45.09,54.48 43.59,46.76 45.14,46.76 8.14,44.88 9.56,45.57 12.05,45.59 10.86,46.3 9.55,48.13 12.09,48.13 34.44,48.18 29.18,45.9 29.9,45.9 79.68,23.42 79.02,23.42 18.64,7.49 61.65,4.14 24.16,8.46 25.83,8.43 27.36,8.46 29.13,8.46 22.23,8.46 20.6,8.43 19.08,8.41 32.28,8.46 33.83,8.48 35.59,8.46 37.31,8.46 39.01,8.46 40.67,8.46 42.29,8.46 43.84,8.46 45.67,8.38 46.86,7.24 47.73,6.35 50.22,4.62 52.78,4.62 55.27,4.65 57.84,4.65 50.44,32.84 50.44,33.63 50.44,34.44 50.44,35.46 50.44,36.55 72.09,20.85 69.09,20.75 70.51,20.8 66.14,19.91 66.17,18.64 65.35,13.92 65.71,16.03 65.71,17.42 70.48,22.5 71.93,22.48 73.3,22.48 71.73,24.18 72.64,24.18 73.66,24.18 74.42,22.45 54.18,13.51 55.27,13.51 56.16,13.79 57.28,13.79 58.22,13.79 59.49,13.79 60.68,13.33 54.34,10.58 55.86,10.56 59.39,10.61 61.15,10.56 63,10.51 59.23,44.15 60.53,44.15 61.98,44.12 59.26,42.9 60.53,42.88 61.9,42.88 59.31,41.63 59.36,40.56 69.57,42.54 71.22,42.57 73.23,42.6
  pour Route2: -1.65,60.45 82.17,60.45 82.68,59.94 82.68,-1.52 81.66,-2.54 -2.79,-2.54 -3.43,-1.9 -3.43,60.45
  pour Bottom (rank 4, no thermals): 2.03,60.2 1.02,60.2 arc90 -2.03,57.15 -2.03,0.25 arc90 0,-1.78 79.25,-1.78 arc90 81.28,0.25 81.28,59.18 arc90 80.26,60.2
  pour Top (rank 4, no thermals): 10.16,60.2 1.02,60.2 arc90 -1.02,58.17 -1.02,0.25 arc90 1.02,-1.78 83.31,-1.78 arc90 86.36,1.27 86.36,55.12 arc90 81.28,60.2
  pour Route15: 14.22,60.2 1.02,60.2 arc90 -2.03,57.15 -2.03,-0.76 arc90 -1.02,-1.78 80.26,-1.78 arc90 83.31,1.27 83.31,59.18 arc90 82.3,60.2
  cutout Top: 12.57,39.1 12.57,-0.64 -1.4,-0.64 -1.52,-0.76 -1.52,39.1
  cutout Bottom (no thermals): 12.57,39.11 12.57,-0.64 -5.97,-0.64 -6.1,-0.76 -6.1,39.11
GND1  (via drill 3.2 pad 6)
  other vias: 5,52.91
GND2  (via drill 3.2 pad 6)
  other vias: 5,5.25
GND3  (via drill 3.2 pad 6)
  other vias: 75.37,5
GND4  (via drill 3.2 pad 6)
  other vias: 75.37,52.66
GREEN  (via drill 0.2)
  Top 0.305: v16.74,39.65 16.71,39.68 16.71,43.66 15.5,44.88 R7.1 | v28.98,35.23 28.98,34.44 28.89,34.44 P2.32
  Bottom 0.305: v28.98,35.23 28.98,35.76 27.99,36.75 24.8,36.75 21.9,39.65 v16.74,39.65
I2S_AMP_SPEAKER_N_L  (via drill 0.2, 0.3 pad 0.51)
  Top 0.254: U7.10 56.09,29.82 v56.46,30.2
  Top 0.508: S2.6 57.49,33.8 v56.8,33.11 56.47,32.78 v56.47,32.3
  Bottom 0.152: 56.46,30.66 v56.46,30.2
  Bottom 0.508: 56.46,30.25 56.46,30.66 56.46,32.77 v56.8,33.11
I2S_AMP_SPEAKER_N_R  (via drill 0.2, 0.3 pad 0.51)
  Top 0.254: U5.10 62.79,29.82 v62.89,29.92
  Top 0.508: v68.15,32.66 v68.16,32.67 S3.6
  Bottom 0.508: v62.89,29.92 67.16,29.92 68.15,30.91 v68.15,32.66 v68.15,33.35
I2S_AMP_SPEAKER_P_L  (via drill 0.2, 0.3)
  Top 0.254: U7.9 55.8,29.32 v56.12,29.01
  Top 0.508: S2.3 57.49,40.26 56.29,39.06 56.29,33.88 55.68,33.27 v55.68,31.95
  Bottom 0.152: 55.82,29.25 55.87,29.25 v56.12,29.01
  Bottom 0.508: 56.06,29.01 55.82,29.25 55.68,29.39 v55.68,31.95 v55.68,32.64
I2S_AMP_SPEAKER_P_R  (via drill 0.2, 0.3 pad 0.51)
  Top 0.254: U5.9 62.65,29.32 v62.87,29.11
  Top 0.508: S3.3 68.16,39.79 v69.7,38.25 v70.18,37.77
  Bottom 0.508: v62.87,29.11 68.89,29.11 71.63,31.85 71.63,36.32 v69.7,38.25
I2S_BCLK  (via drill 0.2)
  Top 0.152: U7.16 53.15,32.05 52.83,32.37 v52.83,32.79 52.83,32.87 | U5.16 59.5,32.58 v59.44,32.64 | S6.1 61.77,21.61 61.77,24 61.03,24.74 v59,24.74
  Bottom 0.152: v59,24.74 59,32.21 v59.44,32.64 59.5,32.7 59.5,33.01 57.51,35 54.1,35 52.63,33.53 52.63,32.99 v52.83,32.79
I2S_BCLK/AUDIO_R  (via drill 0.2)
  Top 0.152: P2.48 14.04,34.48 14.71,33.81 v17.17,33.81 | S6.3 55.78,21.62 TP3.P$1 55.02,24.03 v54.99,24
  Bottom 0.152: v54.99,24 48.69,24 45.64,20.95 31.83,20.95 20.43,32.36 18.62,32.36 v17.17,33.81
I2S_TX  (via drill 0.2)
  Top 0.152: U5.1 58.77,31.59 58.45,31.91 v58.52,31.98 58.52,32.56 TP9.P$1 | P2.44 17,34.88 v16.83,34.71 | U7.1 52.22,31.03 52.22,33.14 52.65,33.58 v53.57,33.58
  Bottom 0.152: v16.83,34.71 16.88,34.66 17.03,34.66 18.86,32.83 21.86,32.83 32.59,22.09 45.11,22.09 48.06,25.04 56.87,25.04 58.55,26.72 58.55,31.95 v58.52,31.98 58.52,33.02 57.19,34.36 54.35,34.36 v53.57,33.58 53.57,33.55
I2S_WS  (via drill 0.2)
  Top 0.152: U7.14 54.15,32.76 v54.33,32.94 | U5.14 60.5,32.59 v60.45,32.64 | v61.19,18.01 61.19,17.12 61.71,16.61 S6.5
  Bottom 0.152: 60.49,32.6 61.47,31.62 61.47,25.76 59.13,23.42 59.13,20.07 v61.19,18.01 | 60.49,32.6 v60.45,32.64 | 60.43,32.64 v60.45,32.64 | 60.49,32.73 60.49,32.6 | v60.45,32.64 60.45,33.17 57.91,35.71 54,35.71 51.92,33.63 51.92,32.56 52.7,31.78 53.93,31.78 54.33,32.18 v54.33,32.94
I2S_WS/AUDIO_L  (via drill 0.2)
  Top 0.152: P2.33 28,35.14 25.17,32.32 v25.17,28.63 | v55.75,17.91 55.71,17.86 S6.7
  Bottom 0.152: v55.75,17.91 55.75,17.93 57.43,19.61 57.43,23.75 56.67,24.5 TP7.P$1 | v25.17,28.63 32.34,21.46 45.34,21.46 48.38,24.5 TP7.P$1 | TP7.P$1 53.56,24.5
  other vias: 53,24.5
MD
  Top 0.152: BUTTON.1 11.93,43.17 12.29,43.54 15.1,43.54 15.43,43.21 BUTTON.2 | BUTTON.2 15.25,42.53 15.24,42.53 | BUTTON.2 14.62,42.71 14.19,42.28 14.19,38.63 15,37.82 P2.46
N$1
  Top 0.152: U9.5 | U9.5 R2.1
N$2
  Top 0.381: R34.1 13.82,47.89 D1.1
N$5  (via drill 0.2)
  Top 0.152: R13.2 66.15,27.66 66.38,27.89 | U1.5 69.25,27.94 68.57,27.25 R45.1 68.19,27.64 67.78,28.04 66.53,28.04 66.38,27.89 | v66.38,27.93 66.38,27.89
  Bottom 0.152: v66.38,27.93 66.39,27.94 TP29.P$1
N$6
  Top 0.152: DEBUG.1 8.14,40.98 9.4,42.25 9.4,43.51 10.69,44.8 D1.2
N$7
  Top 0.152: U13.8 41.34,34.28 40.15,34.28 C33.1
N$8
  Top 0.152: C32.1 R4.1
N$9
  Top 0.152: U10.9 33.73,16.56 32.64,17.65 TP12.P$1
N$11  (via drill 0.2)
  Top 0.152: R33.1 R9.2 76.78,27.74 v76.63,27.89 76.58,27.94 U1.12
  Bottom 0.152: TP28.P$1 76.63,26.98 v76.63,27.89
N$12
  Top 0.152: R31.1 R6.1 C23.1 68.69,23.36 69.47,24.13 U1.8
N$13
  Top 0.508: S5.5 65.66,43.56 64.39,42.29 64.39,38.23 65.66,36.96 S3.5
N$14
  Top 0.152: U5.2 57.56,30.32 | 57.56,30.32 R12.2 | R11.2 57.56,31.02 57.56,30.32
N$15
  Top 0.508: 52.45,50.08 S4.1 52.49,50.8 arc-90 54.52,52.83 55.12,52.83 arc90 56.31,54.02 J1.2
N$16
  Top 0.508: 63.12,50.08 S5.1 63.16,50.67 arc-90 65.19,52.7 65.41,52.7 arc90 66.72,54.02 J2.2
N$17  (via drill 0.2)
  Top 0.152: v18.52,6.03 v18.53,6.02 R37.2
  Bottom 0.152: U4.2 18.07,6.03 v18.52,6.03
  other vias: 16.53,4.48
N$18
  Top 0.305: F1.P$1 23.46,49.45 D6.2 23.4,50.93 23.4,51.13 22.89,51.64 USB.1
  pour Top (no thermals): 22.73,53.72 22.99,53.72 arc-90 23.24,53.47 23.24,51.82 arc90 23.5,51.56 arc-90 23.88,51.18 23.88,49.02 arc-90 23.75,48.89 22.99,48.89 arc-90 22.73,49.15
N$19
  Top 0.152: R18.2 33.94,31.57 34.42,31.09 35.08,31.09 35.28,30.89 U2.5
N$20
  Top 0.152: U13.5 44.69,35.42 L1.P$2 45.87,38.44 D4.1
  pour Top (no thermals): 44.32,39.5 48.26,39.5 arc-90 48.51,39.24 48.51,37.46 46.48,37.46 arc90 45.72,36.7 45.72,35.43 arc-90 45.21,34.92 arc90 44.2,33.91 arc-90 43.94,33.66 43.31,33.66 43.31,34.67 43.43,34.67 arc90 44.07,35.31 44.07,39.24 arc-90
N$21
  Top 0.152: C24.1 R39.1
N$22
  Top 0.508: S5.2 65.66,47.75 67.06,46.36 67.06,42.8 65.91,41.66 65.79,41.66 65.66,41.53 S3.2
N$23
  Top 0.305: RGB.RED 16.71,47.07 R8.2
N$24
  Top 0.152: U13.3 42.77,28.93 R55.2 R14.1 43.59,28.78 TP13.P$1
N$26
  Top 0.305: RGB.BLUE 18.23,45.88 R5.2
N$27
  Top 0.305: RGB.GREEN 16.77,46.24 R7.2
N$28
  Top 0.152: R3.2 34.6,43.54 35.14,42.99 Q3.1
N$29
  Top 0.152: C37.1 26.24,45.32
  pour Top (no thermals): 23.88,45.85 23.88,44.2 arc90 24.13,43.94 28.14,43.94 28.14,45.34 26.16,45.34 26.04,45.47 25.65,45.47 arc-90 25.4,45.72 arc90 25.15,45.97 24,45.97 arc90
N$30
  Top 0.152: R38.2 68.29,24.46 69.23,25.4 U1.7
N$31
  cutout Route2: -5.08,39.09 12.5,39.09 12.5,0.28 -5.08,0.28
N$32
  Top 0.508: J2.1 62.97,55.63 61.68,54.34 arc45 61.21,53.21 61.21,47.66 arc45 61.59,46.74 63.16,45.17 S5.4
N$34
  Top 0.152: U5.4 58.77,28.69 58.57,28.49 R15.2
N$35
  Top 0.152: R32.2 31.06,48.53 30.65,48.94
  Top 0.381: 30.65,48.94 CNG.2
  Top 0.508: CNG.2 29.36,49.01 R1.1
N$37
  cutout Route15 (no thermals): -4.42,39.11 12.42,39.11 12.42,0.48 -4.42,0.48
N$38
  Top 0.152: TP15.P$1 45.1,16.53 43.09,16.53 42.53,15.97 U10.1
N$39
  Top 0.508: J3.P$2 79.4,8.98 R22.2
N$40
  Top 0.152: R39.2 77.15,24.51 76.96,24.51 76.07,25.4 U1.10
N$41
  Top 0.305: 61.83,8.97 C1.1
  Top 0.508: R46.1 61.82,8.96 61.83,8.97
N$42
  Top 0.152: U13.2 42.12,29.55 41.67,29.1 C45.1 R24.2 R25.2
N$43
  Top 0.152: U10.8 34.84,16.47 33.96,17.35 TP18.P$1
N$44  (via drill 0.2)
  Top 0.152: R36.1 v65.92,4.66
  Bottom 0.152: U6.2 64.59,4.13 65.12,4.66 v65.92,4.66
  other vias: 64.13,4.13
N$45
  Top 0.457: U1.9 75.34,23.32 75.95,22.71 R40.2
N$46
  Top 0.152: R27.2 C10.2 C11.2 C12.2 68.09,25.34 68.39,25.34 69.72,26.67 U1.6
N$47
  Top 0.152: R28.2
  Top 0.356: U1.11 76.07,26.67 R28.2
N$49
  Top 0.152: 39.31,44.2 R17.2 C7.1 39.31,43.05 R30.2 | 41.66,42.54 U3.3
  Top 0.381: R29.2 39.31,44.2 | R17.2 39.31,43.05 | C7.1 R30.2 40.32,42.06 40.8,42.54 41.66,42.54
N$51
  Top 0.305: 65.79,12.12 TP16.P$1 | C20.2 63.69,12.06
  Top 0.508: C20.2 65.76,12.15 65.79,12.12 | TP16.P$1 67.06,13.39 67.06,16.27 68.48,17.7 J3.P$6 J3.P$3
N$52
  Top 0.152: R38.1 C22.1
N$53
  Top 0.508: C1.2 63.68,8.92 TP17.P$1 67.14,10.4 J3.P$5 J3.P$4
N$59
  Top 0.508: S4.5 54.99,43.23 53.85,42.09 53.85,38.99 54.74,38.1 54.99,37.84 S2.5
N$60
  Top 0.508: S4.2 54.99,46.97 56.13,45.82 56.13,42.8 54.99,41.66 S2.2
N$61
  Top 0.152: R42.2 51.52,29.29 51.52,29.32 U7.4
N$62
  Top 0.152: U7.2 51.53,30.32 51.48,30.26 R43.2 R44.2
N$64
  Top 0.508: S4.4 52.49,44.65 arc45 51.94,45.97 50.76,47.16 arc-45 50.16,48.59 50.16,52.14 arc-45 50.76,53.58 J1.1
N$67
  Top 0.152: R4.2 40.65,29.6 41.1,30.06 U13.1
N$70
  Top 0.305: 77.91,17.72 J3.P$1
  Top 0.457: 77.91,18.16 77.91,17.72
  Top 0.508: R49.1 76.78,20.99 76.78,20.11 77.91,18.98 77.91,18.16
N$72
  Top 0.508: R50.1 61.92,12.11 C20.1
N$76  (via drill 0.2)
  Top 0.152: C3.1 41.24,38.61 C82.1 C131.1 | 42.12,34.72 U13.7 | U13.6 42.77,34.67 42.69,34.75 L1.P$1 | R55.1 42.57,27.08 v42.55,27.05
  Bottom 0.152: v42.55,27.05 42.55,27.18 40.7,29.02 40.7,34.48 v41.72,35.5
  pour Top (no thermals): 40.89,41.02 42.67,41.02 arc-90 43.18,40.51 43.18,35.18 arc-90 43.05,35.05 arc90 42.93,34.92 42.93,33.66 41.91,33.66 41.91,35.05 arc90 41.78,35.18 40.89,35.18 arc-90 40.77,35.31 40.77,40.89 arc-90
RED  (via drill 0.2)
  Top 0.305: R8.1 15.5,48.76 v15.47,48.79 | v30.43,32.31 29.6,31.48 P2.29
  Bottom 0.305: v15.47,48.79 15.52,48.74 15.97,48.74 26.05,38.66 28.93,38.66 31.39,36.2 31.39,33.27 v30.43,32.31
SCL
  Top 0.152: TP11.P$1 25.96,35.92 P2.35
SDA
  Top 0.152: TP6.P$1 25,37.88 P2.36
SPI1_CS_SD  (via drill 0.2)
  Top 0.152: P2.53 15.15,29.48 16.31,28.32 v17.53,28.32 | U10.2 41.4,15.04 41.4,16.13 v41.83,16.56 42.37,17.09 44.3,17.09 44.8,17.6 TP14.P$1
  Bottom 0.152: v17.53,28.32 17.53,28.3 21.52,28.3 33.26,16.56 v41.83,16.56
SPI1_MISO_SD  (via drill 0.2)
  Top 0.152: U10.7 35.94,17.11 R16.2 35.28,17.13 34.9,17.51 34.9,18.8 TP2.P$1 34.82,18.87 v34.82,19.56 | P2.51 14.84,31.48 15.57,32.21 v17.2,32.21
  Bottom 0.152: v17.2,32.21 17.96,31.45 20.06,31.45 26.8,24.71 26.8,24.69 31.96,19.53 34.8,19.53 v34.82,19.56
SPI1_MOSI_SD  (via drill 0.2)
  Top 0.152: P2.45 16,34.92 v15.98,34.9 | U10.3 R23.2 | R23.2 | R23.2 41.6,17.14 42.67,18.21 TP8.P$1 42.67,19.28 v41.78,20.17
  Bottom 0.152: v41.78,20.17 31.97,20.17 20.24,31.9 18.36,31.9 15.98,34.29 v15.98,34.9
SPI1_SCK_SD  (via drill 0.2)
  Top 0.152: U10.5 R19.2 37.35,17.13 v37.34,17.14 | P2.52 14.6,30.48 15.72,31.6 v16.61,31.6 | v33.55,18.77 TP19.P$1
  Bottom 0.152: v16.61,31.6 17.2,31.01 19.74,31.01 32,18.75 33.53,18.75 33.55,18.72 v33.55,18.77 33.58,18.77 34.9,17.45 35.2,17.14 v37.34,17.14
SW
  Top 0.381: L2.P$1 33.8,29.11 34.78,30.1 U2.4
  pour Top (no thermals): 34.16,30.73 34.92,30.73 34.92,29.59 34.8,29.46 arc90 34.42,29.08 34.42,26.29 arc-90 34.16,26.04 32.77,26.04 arc-90 32.64,26.16 32.64,28.7 arc-90 33.27,29.34 33.53,29.34 arc90 34.04,29.85 34.04,30.61 arc-90
VBAT  (via drill 0.2)
  Top 0.152: 27.48,48.96 v27.48,48.95
  Top 0.305: Q3.3 36.09,46.32 C25.2 36.18,46.63 | 37.42,49.07 J4.2
  other vias: 38.74,49.85 27.48,48.23 38.21,50.49 38.23,49.93 38.21,49.37 38.74,50.46 28.19,48.95 28.19,48.23 38.77,49.35
  pour Top (no thermals): 36.96,52.96 38.73,52.96 arc-90 39.12,52.58 39.12,48.01 arc-90 38.61,47.5 arc90 37.21,46.1 37.21,44.45 arc-90 36.58,43.81 35.69,43.81 35.69,46.99 arc-90 35.81,47.12 36.07,47.12 arc90 36.83,47.88 36.83,52.83 arc-90
  pour Top (no thermals): 27.33,49.23 28.24,49.23 arc-90 28.55,48.92 28.55,48.31 arc-90 28.14,47.9 arc90 28.04,47.8 28.04,46.58 arc-90 27.94,46.48 27.43,46.48 arc-90 27.13,46.79 27.13,49.02 arc-90
  pour Bottom: 27.2,50.57 27.2,48.13 arc90 27.41,47.93 28.4,47.93 arc90 28.57,48.11 28.57,48.77 arc-90 28.88,49.07 38.91,49.07 arc90 39.09,49.25 39.09,50.67 arc90 38.96,50.8 27.38,50.8 arc90 27.2,50.62
VBAT_MEAS
  Top 0.152: P2.12 25,14.84 TP4.P$1
VIN
  Top 0.254: L22.2 38.76,40.74 38.35,41.15 38.35,42.05 R30.1 37.31,42.06 37.04,42.33 Q3.2 | R54.2 34.14,32.54 34.47,32.21 34.6,32.21 | 34.09,32.46 34.59,32.46 | C40.2
  Top 0.508: 34.45,36.45 34.45,37.7 35.56,38.38 D2.CATHODE 35.84,38.89 36.03,39.07 36.03,40.45 37.04,41.47 Q3.2 | C40.2 C6.1 C46.1 34.51,33.35 34.51,32.55 34.59,32.46
  pour Top (no thermals): 36.7,42.93 37.47,42.93 arc-90 37.72,42.67 37.72,42.42 arc90 37.85,42.29 38.61,42.29 38.61,41.53 arc90 38.86,41.27 40.26,41.27 40.26,40.39 37.97,40.39 arc90 37.59,40 37.59,37.85 arc-90 37.34,37.59 35.94,37.59 arc90 34.8,36.45 34.8,32.64 arc90 34.92,32.51 34.92,32 34.16,32 arc-90 34.04,32.13 arc90 33.91,32.26 33.15,32.26 33.15,36.32 arc-90 33.78,36.96 arc90 34.29,37.46 34.29,40.26 arc-90 34.92,40.89 35.81,40.89 arc90 36.7,41.78
VUSB
  Top 0.254: 32.55,44.02 32.73,43.63 R26.2 R3.1
  Top 0.508: D2.ANODE 33.21,40.2 32.77,40.64 32.77,42.53 R26.2 32.69,42.6 32.69,43.87 32.55,44.02
  pour Top (no thermals): 25.68,51.08 31.6,51.08 arc-90 33.53,49.15 33.53,45.59 arc-90 33.15,45.21 arc90 33.02,45.09 33.02,40.77 arc90 33.4,40.39 arc-90 33.66,40.13 33.66,38.23 arc-90 33.4,37.97 32,37.97 arc-90 31.88,38.1 31.88,45.59 arc-90 32.26,45.97 arc90 32.38,46.1 32.38,48.26 arc90 30.58,50.06 27.84,50.06 arc90 25.65,47.88 25.65,47.37 arc-90 25.27,46.99 23.88,46.99 arc-90 23.75,47.12 23.75,48.13 arc-90 23.88,48.26 24.26,48.26 arc90 24.64,48.64 24.64,50.04 arc-90

## Text on the board
tPlace: - | + | - | + | ON | OFF | S4 | S5 | SPEAKER | S4 | S5 | MODE | RESET | S2 | AMP | I2S | S3 | GND | S2 | TX | S3 | 5V | BCLK | 5V | WS | PO | AMP | I2S | 3V3 | MISO | S6 | SCK | MOSI | 3 | GND | 1 | 2 | GND | CS | S6 | DATA | AUDIO V0.0.0 | 20230608 | CLK | J3 | GND
tNames: RGB | RESET | U$2
tValues: RGB | SS3P3 | BUTTON | BUTTON
bValues: XC9258